# EAGLE design amplifier_modified2 (EAGLE 6.1)
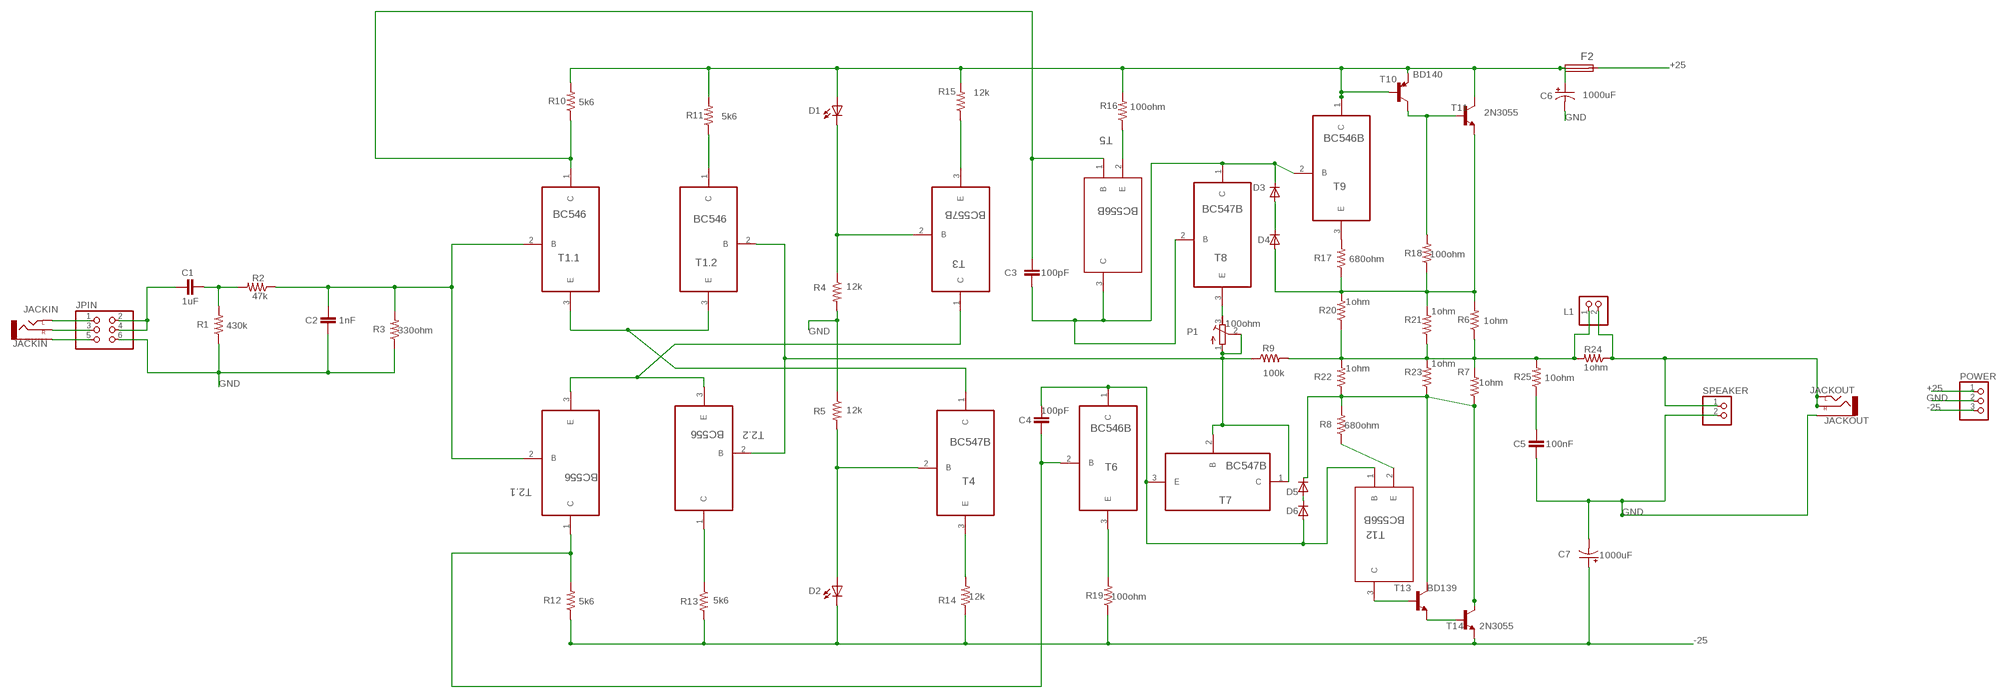
[diagram p0: schematic, sheet 1]

## Parts
C1  1uF  CAPPTH1  [CAP-PTH-5MM]
C2  1nF  CAPPTH1  [CAP-PTH-5MM]
C3  100pF  C5/3  [C5B3]
C4  100pF  C5/3  [C5B3]
C5  100nF  C5/3  [C5B3]
C6  1000uF  CPOL-USE5-6  [E5-6]
C7  1000uF  CPOL-USE5-6  [E5-6]
D1  LED5MM  [LED5MM]
D2  LED5MM  [LED5MM]
D3  1N4148DO35-10  [DO35-10]
D4  1N4148DO35-10  [DO35-10]
D5  1N4148DO35-10  [DO35-10]
D6  1N4148DO35-10  [DO35-10]
F2  FUSEBLANK_5X20MM  [FUSE_HOLDER_5X20MM]
JACKIN  JACKIN  AUDIO-JACK2.5MM  [STEREOJACK2.5MM_STEREOJACK2.5MM]
JACKOUT  JACKOUT  AUDIO-JACK2.5MM  [STEREOJACK2.5MM_STEREOJACK2.5MM]
JPIN  PINHD-2X3/90  [2X03/90]
L1  PINHD-1X2/90  [1X02/90]
P1  100ohm  R-TRIMM74X  [RTRIM74X]
POWER  PINHD-1X3/90  [1X03/90]
R1  430k  RESISTORPTH-2W  [AXIAL-0.8]
R2  47k  RESISTORPTH-2W  [AXIAL-0.8]
R3  330ohm  RESISTORPTH-2W  [AXIAL-0.8]
R4  12k  RESISTORPTH-2W  [AXIAL-0.8]
R5  12k  RESISTORPTH-2W  [AXIAL-0.8]
R6  1ohm  RESISTORPTH-2W  [AXIAL-0.8]
R7  1ohm  RESISTORPTH-2W  [AXIAL-0.8]
R8  680ohm  RESISTORPTH-2W  [AXIAL-0.8]
R9  100k  RESISTORPTH-2W  [AXIAL-0.8]
R10  5k6  RESISTORPTH-2W  [AXIAL-0.8]
R11  5k6  RESISTORPTH-2W  [AXIAL-0.8]
R12  5k6  RESISTORPTH-2W  [AXIAL-0.8]
R13  5k6  RESISTORPTH-2W  [AXIAL-0.8]
R14  12k  RESISTORPTH-2W  [AXIAL-0.8]
R15  12k  RESISTORPTH-2W  [AXIAL-0.8]
R16  100ohm  RESISTORPTH-2W  [AXIAL-0.8]
R17  680ohm  RESISTORPTH-2W  [AXIAL-0.8]
R18  100ohm  RESISTORPTH-2W  [AXIAL-0.8]
R19  100ohm  RESISTORPTH-2W  [AXIAL-0.8]
R20  1ohm  RESISTORPTH-2W  [AXIAL-0.8]
R21  1ohm  RESISTORPTH-2W  [AXIAL-0.8]
R22  1ohm  RESISTORPTH-2W  [AXIAL-0.8]
R23  1ohm  RESISTORPTH-2W  [AXIAL-0.8]
R24  1ohm  RESISTORPTH-2W  [AXIAL-0.8]
R25  10ohm  RESISTORPTH-2W  [AXIAL-0.8]
SPEAKER  PINHD-1X2/90  [1X02/90]
T1.1  BC546  BC546B  [TO127P254X732-3]
T1.2  BC546  BC546B  [TO127P254X732-3]
T2.1  BC556  BC556B  [TO127P254X732-3]
T2.2  BC556  BC556B  [TO127P254X732-3]
T3  BC557B  [TO127P254X732-3]
T4  BC547B  [TO127P254X732-3]
T5  BC556B  BC857A  [SOT95P240X110-3N]
T6  BC546B  [TO127P254X732-3]
T7  BC547B  [TO127P254X732-3]
T8  BC547B  [TO127P254X732-3]
T9  BC546B  [TO127P254X732-3]
T10  BD140  [TO126]
T11  2N3055  [TO3]
T12  BC556B  BC857A  [SOT95P240X110-3N]
T13  BD139  [TO126]
T14  2N3055  [TO3]

## Nets
+25: F2.2 POWER.1
-25: C7.+ D2.K(C) POWER.3 R12.P$1 R13.P$2 R14.P$1 R19.P$1 T14.E
GND: C2.1 C5.1 C6.- C7.- JACKOUT.RING1(SLEEVE) JPIN.6 POWER.2 R1.P$1 R3.P$1 R4.P$2 R5.P$1 SPEAKER.2
N$1: JACKIN.SHIELD(LEFT) JPIN.1
N$2: C1.2 R1.P$2 R2.P$2
N$4: C2.2 R2.P$1 R3.P$2 T1.1.2(B) T2.1.2(B)
N$5: P1.3(E) T8.3(E)
N$6: T2.1.3(E) T2.2.3(E) T3.1(C)
N$7: P1.1(A) P1.2(S) R9.P$1 T1.2.2(B) T2.2.2(B) T7.1(C) T7.2(B)
N$8: C3.2 R10.P$1 T1.1.1(C) T5.1(B)
N$9: T1.1.3(E) T1.2.3(E) T4.1(C)
N$10: C4.1 R12.P$2 T2.1.1(C) T6.2(B)
N$12: R11.P$1 T1.2.1(C)
N$13: C5.2 R25.P$1
N$14: D1.K(C) R4.P$1 T3.2(B)
N$15: R13.P$1 T2.2.1(C)
N$17: D2.A R5.P$2 T4.2(B)
N$18: R14.P$2 T4.3(E)
N$19: R15.P$1 T3.3(E)
N$20: R16.P$1 T5.2(E)
N$21: C3.1 D3.C T5.3(C) T8.1(C) T8.2(B) T9.2(B)
N$22: R19.P$2 T6.3(E)
N$23: C4.2 D6.A T6.1(C) T7.3(E) T12.1(B)
N$24: JACKIN.RING1(SLEEVE) JPIN.5
N$25: JACKIN.TIP(RIGHT) JPIN.3
N$26: D5.A D6.C
N$27: R17.P$2 T9.3(E)
N$28: D3.A D4.C
N$29: D4.A R6.P$2 R17.P$1 R18.P$1 R20.P$2 R21.P$2 T11.E
N$30: C6.+ D1.A F2.1 R10.P$2 R11.P$2 R15.P$2 R16.P$2 T9.1(C) T10.1(E) T10.3(B) T11.C T11.C/(C)
N$31: R18.P$2 T10.2(C) T11.B
N$32: R8.P$1 T12.2(E)
N$33: T12.3(C) T13.3(B)
N$34: T13.1(E) T14.B
N$35: JACKOUT.SHIELD(LEFT) JACKOUT.TIP(RIGHT) L1.2 R24.P$1 SPEAKER.1
N$36: L1.1 R6.P$1 R7.P$2 R9.P$2 R20.P$1 R21.P$1 R22.P$2 R23.P$2 R24.P$2 R25.P$2
N$37: D5.C R7.P$1 R8.P$2 R22.P$1 R23.P$1 T13.2(C) T14.C T14.C/(C)
N$40: C1.1 JPIN.2 JPIN.4

## Library data of the parts
C1 C2 = SparkFun-Capacitors:CAP: Capacitor Standard 0603 ceramic capacitor, and 0.1" leaded capacitor.
C3-C5 = capacitor-wima:C: CAPACITOR naming: grid - package width
C6 C7 = rcl:CPOL-US: POLARIZED CAPACITOR, American symbol
D1 D2 = led:LED: LED OSRAM: - CHIPLED LG R971, LG N971, LY N971, LG Q971, LY Q971, LO R971, LY R971 LH N974, LH R974 LS Q976, LO Q976, LY Q976 LO Q996 - Hyper CHIPLED LW Q18S LB Q993, LB Q99A, LB R99A - SideLED LS A670, LO A670, LY A670, LG A670, LP A670 LB A673, LV A673, LT A673, LW A673 LH A674 LY A675 LS A676, LA A676, LO A676, LY A676, LW A676 LS A679, LY A679, LG A679 - Hyper Micro SIDELED® LS Y876, LA Y876, LO Y876, LY Y876 LT Y87S - SmartLED LW L88C, LW L88S LB L89C, LB L89S, LG L890 LS L89K, LO L89K, LY L89K LS L896, LA L896, LO L896, LY L896 - TOPLED LS T670, LO T670, LY T670, LG T670, LP T670 LSG T670, LSP T670, LSY T670, LOP T670, LYG T670 LG T671, LOG T671, LSG T671 LB T673, LV T673, LT T673, LW T673 LH T674 LS T676, LA T676, LO T676, LY T676, LB T676, LH T676, LSB T676, LW T676 LB T67C, LV T67C, LT T67C, LS T67K, LO T67K, LY T67K, LW E67C LS E67B, LA E67B, LO E67B, LY E67B, LB E67C, LV E67C, LT E67C LW T67C LS T679, LY T679, LG T679 LS T770, LO T770, LY T770, LG T770, LP T770 LB T773, LV T773, LT T773, LW T773 LH T774 LS E675, LA E675, LY E675, LS T675 LS T776, LA T776, LO T776, LY T776, LB T776 LHGB T686 LT T68C, LB T68C - Hyper Mini TOPLED® LB M676 - Mini TOPLED Santana® LG M470 LS M47K, LO M47K, LY M47K Source: http://www.osram.convergy.de LUXEON: - LUMILED® LXK2-PW12-R00, LXK2-PW12-S00, LXK2-PW14-U00, LXK2-PW14-V00 LXK2-PM12-R00, LXK2-PM12-S00, LXK2-PM14-U00 LXK2-PE12-Q00, LXK2-PE12-R00, LXK2-PE12-S00, LXK2-PE14-T00, LXK2-PE14-U00 LXK2-PB12-K00, LXK2-PB12-L00, LXK2-PB12-M00, LXK2-PB14-N00, LXK2-PB14-P00, LXK2-PB14-Q00 LXK2-PR12-L00, LXK2-PR12-M00, LXK2-PR14-Q00, LXK2-PR14-R00 LXK2-PD12-Q00, LXK2-PD12-R00, LXK2-PD12-S00 LXK2-PH12-R00, LXK2-PH12-S00 LXK2-PL12-P00, LXK2-PL12-Q00, LXK2-PL12-R00 Source: www.luxeon.com KINGBRIGHT: KA-3528ASYC Source: www.kingbright.com
D3-D6 = diode:1N4148: DIODE high speed (Philips)
F2 = fuse:FUSE: Fuse; OC_FARNELL: unknown; OC_NEWARK: unknown
JACKIN JACKOUT = SparkFun-Connectors:AUDIO-JACK: 3.5mm Audio Jack Simple 3.5mm common PCB mount audio jack. SKU: PRT-08032
JPIN = pinhead:PINHD-2X3: PIN HEADER
L1 SPEAKER = pinhead:PINHD-1X2: PIN HEADER
P1 = rcl:R-TRIMM: Trimm resistor
POWER = pinhead:PINHD-1X3: PIN HEADER
R1-R5 R8-R19 R25 = SparkFun-Resistors:RESISTOR: Resistor Basic schematic elements and footprints for 0603, 1206, and PTH resistors.
R6 R7 R20-R24 = SparkFun-Passives:RESISTOR: Resistor Basic schematic elements and footprints for 0603, 1206, and PTH resistors.
T1.1 T1.2 T6 T9 = Fairchild_By_element14_Batch_1:BC546B: NPN Epitaxial Silicon Transistor; MPN: BC546B; OC_FARNELL: 1467868; OC_NEWARK: 58K8752; PACKAGE: TO-92; SUPPLIER: Fairchild
T2.1 T2.2 = Fairchild_By_element14_Batch_1:BC556B: PNP Epitaxial Silicon Transistor; MPN: BC556B; OC_FARNELL: 1467881; OC_NEWARK: 58K8759; PACKAGE: TO-92; SUPPLIER: Fairchild
T3 = Fairchild_By_element14_Batch_1:BC557B: PNP Epitaxial Silicon Transistor; MPN: BC557B; OC_FARNELL: 1017678; OC_NEWARK: 58K0100; PACKAGE: TO-92; SUPPLIER: Fairchild
T4 T7 T8 = Fairchild_By_element14_Batch_1:BC547B: NPN Epitaxial Silicon Transistor; MPN: BC547B; OC_FARNELL: 1017673; OC_NEWARK: 67K3328; PACKAGE: TO-92; SUPPLIER: Fairchild
T5 T12 = Diodes_Inc_By_element14_Batch_1:BC857A: PNP SURFACE MOUNT SMALL SIGNAL TRANSISTOR IN SOT23; MPN: BC857A; OC_FARNELL: 1902487; OC_NEWARK: -; PACKAGE: SOT-23-3; SUPPLIER: DIODES INC.
T10 = transistor-pnp:BD140: PNP Transistor
T11 T14 = transistor:2N3055: NPN TRANSISTOR
T13 = transistor:BD139: NPN TRANSISTOR

## Net classes
0 probots: width 0.406 mm, drill 0.762 mm, clearance 0.457 mm

## Board
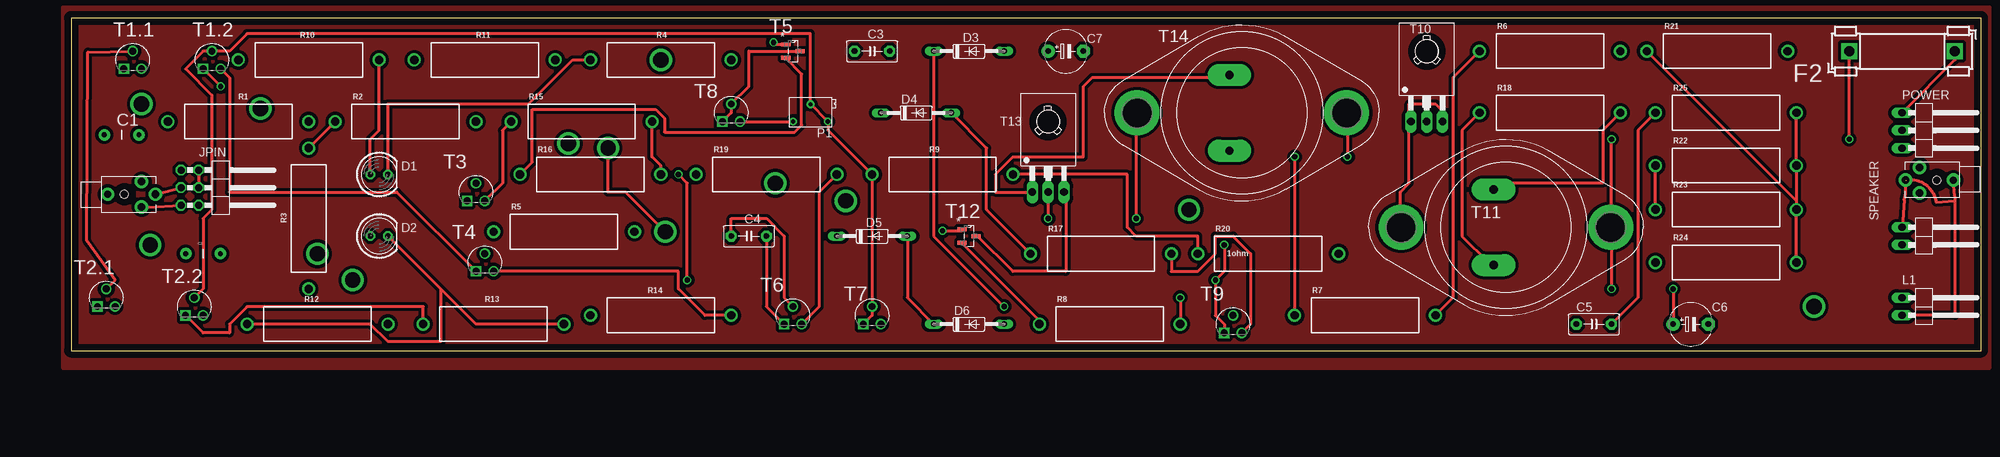
[diagram p1: board, top side]
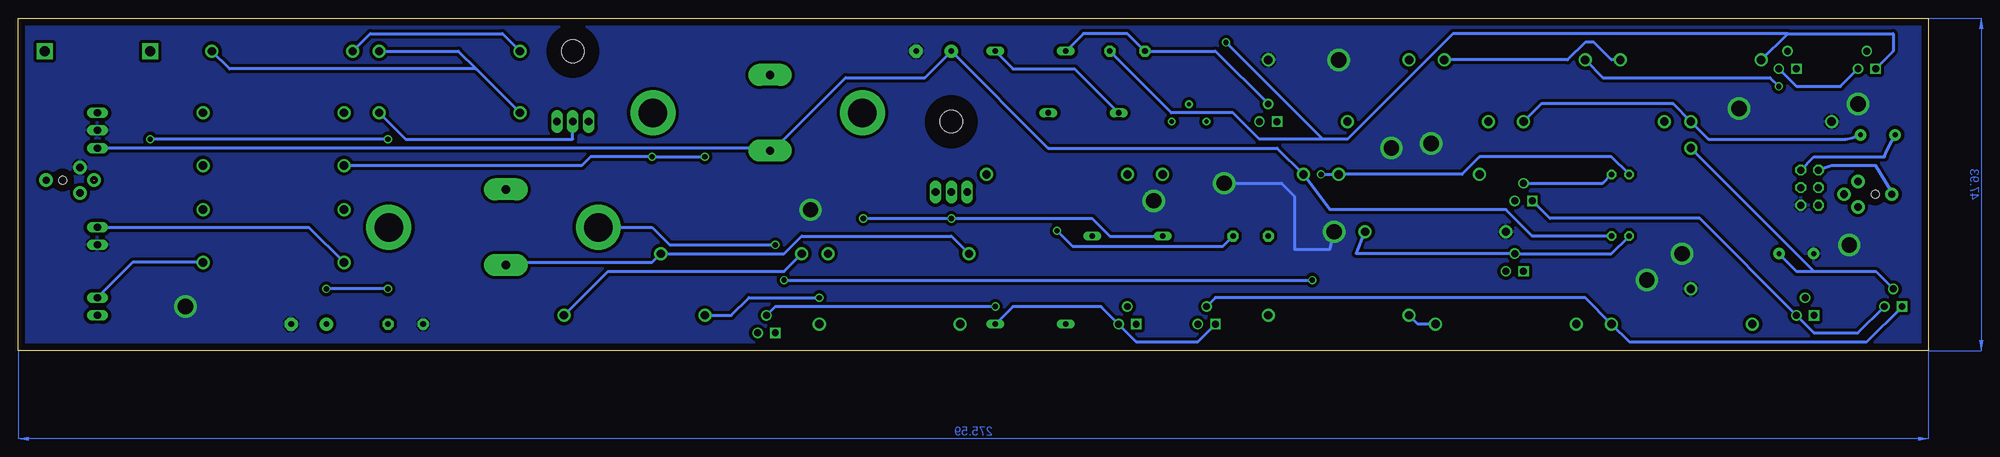
[diagram p2: board, bottom side, seen from below]

Size 275.57 x 47.93 mm. Coordinates in mm from the lower left corner, seen from the top.
Outline: 0,0 275.57,0 275.57,47.93 0,47.93 0,0
Copper layers (1*16): Top 0.035mm / dielectric 1.5mm / Bottom 0.035mm
Design rules: minimum track width 16mil, minimum drill 30mil, track to track 18mil, track to pad 8mil, pad to pad 8mil, via to via 8mil, smd to smd 8mil, copper to edge 40mil, drill to drill 8mil, minimum pad ring 10mil, minimum via ring 8mil, stop-mask expansion 4mil, vias tented up to drill 0mil, thermal gap 10mil

### Footprints (pad centres in the part's own frame; a part is rotated, then mirrored left to right if it is on the bottom)
CAP-PTH-5MM = drill 0.7 pad 1.651: 1 -2.5,0; 2 2.5,0
C5B3 = drill 0.813 pad 1.6 octagon: 1 -2.54,0; 2 2.54,0
E5-6 = drill 0.813 pad 1.905: + -2.54,0 | drill 0.813 pad 1.905 octagon: - 2.54,0
LED5MM = drill 0.813 octagon: A -1.27,0; K 1.27,0
DO35-10 = drill 0.813 long: A 5.08,0; C -5.08,0
FUSE_HOLDER_5X20MM = drill 1.422 pad 2.286 square: 1 0,0; 2 15.24,0
STEREOJACK2.5MM_STEREOJACK2.5MM = drill 1.1 pad 1.93: RING1 2.5,-1.85; RING2 2.5,1.85; TIP 4.5,0 | drill 1 pad 1.93: SHIELD -2.4,0 | hole 1.2: 0,0
2X03/90 = drill 1.016 octagon: 1 -2.54,-6.35; 2 -2.54,-3.81; 3 0,-6.35; 4 0,-3.81; 5 2.54,-6.35; 6 2.54,-3.81
1X02/90 = drill 1.016 long: 1 -1.27,-3.81; 2 1.27,-3.81
RTRIM74X = drill 0.61: 1 -1.25,-2.5; 2 1.25,0; 3 -1.25,2.5
1X03/90 = drill 1.016 long: 1 -2.54,-3.81; 2 0,-3.81; 3 2.54,-3.81
AXIAL-0.8 = drill 1.2 pad 1.88: P$1 -10.16,0; P$2 10.16,0
TO127P254X732-3 = drill 0.991 square: 1 -2.54,-2.54 | drill 0.991: 2 -1.27,0; 3 0,-2.54
SOT95P240X110-3N = smd 1.321 x 0.559: 1 -1.016,0.965; 2 -1.016,-0.965; 3 1.016,0
TO126 = drill 1.118 long: 1 -2.286,-5.08; 2 0,-5.08; 3 2.286,-5.08 | hole 3.302: 0,5.08
TO3 = drill 1.194 pad 3.15 long: B -1.778,5.461; E -1.778,-5.461 | drill 4.115 pad 6.477: C 15.113,0; C/ -15.113,0

### Placement (x,y rotation side)
C1  7.3,31.11 0 top
C2  19.05,13.97 0 top
C3  115.57,43.18 0 top
C4  97.79,16.51 0 top
C5  219.71,3.81 0 top
C6  233.68,3.81 0 top
C7  143.51,43.18 0 top
D1  44.45,25.4 0 top
D2  44.45,16.51 0 top
D3  129.54,43.18 0 top
D4  121.92,34.29 0 top
D5  115.57,16.51 0 top
D6  129.54,3.81 0 top
F2  256.54,43.18 0 top
JACKIN  7.68,22.54 0 top
JACKOUT  269.18,24.57 180 top
JPIN  22.23,23.5 270 top
L1  267.97,6.35 270 top
P1  106.68,34.29 90 top
POWER  267.97,31.75 270 top
R1  24.13,33.02 0 top
R2  48.26,33.02 0 top
R3  34.29,19.05 90 top
R4  85.09,41.91 0 top
R5  71.12,17.14 0 top
R6  213.36,43.18 0 top
R7  186.69,5.08 0 top
R8  149.86,3.81 0 top
R9  125.73,25.4 0 top
R10  34.29,41.91 0 top
R11  59.69,41.91 0 top
R12  35.56,3.81 0 top
R13  60.96,3.81 0 top
R14  85.09,5.08 0 top
R15  73.66,33.02 0 top
R16  74.93,25.4 0 top
R17  148.59,13.97 0 top
R18  213.36,34.29 0 top
R19  100.33,25.4 0 top
R20  172.72,13.97 0 top
R21  237.49,43.18 0 top
R22  238.76,26.67 0 top
R23  238.76,20.32 0 top
R24  238.76,12.7 0 top
R25  238.76,34.29 0 top
SPEAKER  267.97,16.51 270 top
T1.1  10.16,43.18 0 top
T1.2  21.59,43.18 0 top
T2.1  6.35,8.89 0 top
T2.2  19.05,7.62 0 top
T3  59.69,24.13 0 top
T4  60.96,13.97 0 top
T5  104.14,43.18 0 top
T6  105.41,6.35 0 top
T7  116.84,6.35 0 top
T8  96.52,35.56 0 top
T9  168.91,5.08 0 top
T10  195.58,38.1 0 top
T11  207.01,17.78 0 top
T12  129.54,16.51 0 top
T13  140.97,27.94 0 top
T14  168.91,34.29 0 top

### Tracks (layer width: path | path; a pad name or v marks a point on that pad's centre or on a via)
+25
  Top 0.406: POWER.1 271.78,41.91 F2.2
-25
  Top 0.406: 53.34,8.89 58.42,3.81 R13.P$2 | 53.34,8.89 D2.K | R12.P$1 43.18,3.81 45.72,1.27 53.34,1.27 53.34,8.89
  Bottom 0.406: R14.P$1 73.66,3.81 R13.P$2 | D2.K 57.15,16.51 60.96,20.32 86.36,20.32 R19.P$1 93.98,29.21 127,29.21 C7.+ 144.78,39.37 156.21,39.37 166.37,29.21 T14.E 167.64,29.21 POWER.3
GND  (via drill 2.2)
  Top 0.406: v77.47,29.21 77.47,22.86 80.01,22.86 v85.73,17.14
  Bottom 0.406: v101.6,24.13 93.34,24.13 91.44,22.22 91.44,14.61 86.36,14.61 v85.73,17.14
  other vias: 40.64,10.16 35.56,13.97 11.43,15.24 27.3,34.92 111.76,21.59 161.29,20.32 251.46,6.35 10.16,35.56 85.09,41.91 71.75,29.84
  pour Bottom: -2.54,53.34 -2.54,-6.35 279.4,-6.35 279.4,53.34
N$1
  Bottom 0.406: JPIN.1 13.97,26.67 7.62,26.67 5.46,23.11 JACKIN.SHIELD
N$2
  Bottom 0.406: C1.2 10.99,30.67 11.94,30.48 31.75,30.48 R1.P$2 36.83,35.56 55.88,35.56 R2.P$2
N$4
  Top 0.406: R2.P$1 R3.P$2 | T1.1.2 2.41,43.05 2.29,15.81 4.38,12.95 6.35,10.16 T2.1.2
  Bottom 0.406: T2.1.2 7.62,11.43 16.51,11.43 | 16.51,11.43 19.05,11.43 21.59,13.97 C2.2 | 16.51,11.43 R3.P$2
N$5
  Top 0.406: T8.3 104.14,33.02 P1.3
N$6
  Bottom 0.406: T2.1.3 10.16,2.54 16.51,2.54 T2.2.3 33.02,19.05 54.61,19.05 T3.1
N$7
  Top 0.406: T2.2.2 19.05,8.89 19.05,19.05 20.32,20.32 20.32,36.83 16.51,40.64 19.05,43.18 T1.2.2 22.86,43.18 25.4,45.72 106.68,45.72 106.68,35.56 | T7.1 115.57,5.08 T7.2 R9.P$1 109.22,31.75 109.22,33.02 | 109.22,33.02 106.68,35.56 | 109.22,33.02 P1.1 | 106.68,35.56 P1.2
N$8  (via drill 0.76)
  Top 0.406: v101.35,44.45 101.35,44.2 103.12,44.2 T5.1
  Bottom 0.406: T1.1.1 5.08,43.18 5.08,45.72 20.32,45.72 | R10.P$1 20.32,45.72 | C3.2 109.22,34.29 100.33,34.29 96.52,30.48 87.38,30.48 | 87.38,30.48 83.82,30.48 68.58,45.72 20.32,45.72 | 87.38,30.48 v101.35,44.45
N$9
  Top 0.406: T4.1 46.99,22.86 22.86,22.86 22.86,39.37 T1.2.3
  Bottom 0.406: T1.1.3 12.7,38.1 19.05,38.1 T1.2.3
N$10
  Top 0.406: T6.2 102.87,7.62 102.87,16.51 100.33,19.05 95.25,19.05 C4.1
  Bottom 0.406: T2.1.1 8.89,1.27 43.18,1.27 R12.P$2 49.53,7.62 102.87,7.62 T6.2
N$11
  pour Top: -1.27,49.53 -1.27,-2.54 276.86,-2.54 276.86,49.53
N$12  (via drill 0.76)
  Top 0.406: v21.59,38.1 T1.2.1
  Bottom 0.406: v21.59,38.1 22.86,39.37 46.99,39.37 R11.P$1
N$13
  Top 0.406: C5.2 226.06,7.62 226.06,31.75 R25.P$1
N$14
  Top 0.406: R4.P$1 72.39,41.91 66.04,35.56 45.72,35.56 D1.K
  Bottom 0.406: D1.K 46.99,24.13 T3.2
N$15
  Top 0.406: T2.2.1 19.05,2.54 22.86,2.54 22.86,3.81 25.4,6.35 50.8,6.35 R13.P$1
N$17
  Bottom 0.406: D2.A 45.72,13.97 T4.2 82.55,13.97 R5.P$2
N$18
  Top 0.406: T4.3 87.63,11.43 87.63,8.89 91.44,5.08 R14.P$2
N$19
  Top 0.406: T3.3 62.23,24.13 62.23,31.75 R15.P$1
N$20
  Top 0.406: R16.P$1 66.55,27.18 66.55,34.8 84.33,34.8 85.6,33.53 85.6,31.5 104.39,31.5 105.41,32.51 105.41,39.88 103.12,42.16 T5.2
N$21  (via drill 0.76)
  Top 0.406: 105.41,43.18 T5.3 97.79,43.18 97.79,38.1 T8.2 95.25,34.29 T8.1 | v134.62,6.35 124.46,16.51 D3.C
  Bottom 0.406: D3.C 121.92,45.72 115.57,45.72 C3.1 102.87,43.18 T8.2 | T9.2 166.37,6.35 v134.62,6.35
N$22
  Top 0.406: T6.3 107.95,6.35 107.95,22.86 R19.P$2
N$23  (via drill 0.76)
  Top 0.406: T6.1 100.33,6.35 C4.2 | v125.73,17.27 128.52,17.27 T12.1
  Bottom 0.406: D6.A 132.08,6.35 119.38,6.35 T7.3 114.3,1.27 105.41,1.27 T6.1 | v125.73,17.27 123.44,14.99 101.85,14.99 C4.2
N$24
  Top 0.406: JPIN.5 11.05,20.64 JACKIN.RING1
N$25
  Top 0.406: JACKIN.TIP JPIN.3
N$26
  Top 0.406: D6.C 120.65,7.62 D5.A
N$27
  Top 0.406: T9.3 170.18,3.81 170.18,13.97 167.64,16.51 165.1,16.51 165.1,13.97 162.56,11.43 158.75,11.43 R17.P$2
N$28
  Bottom 0.406: D4.C 123.19,40.64 132.08,40.64 D3.A
N$29
  Top 0.406: D4.A 132.08,29.21 132.08,20.32 R17.P$1 | R18.P$1 200.66,31.75 200.66,16.51 204.47,12.7 T11.E
  Bottom 0.406: T11.E 204.47,12.7 184.15,12.7 R20.P$2 165.1,13.97 162.56,16.51 140.97,16.51 R17.P$1 | 209.55,40.64 212.09,43.18 R6.P$2 | 209.55,40.64 R18.P$1 | R21.P$2 245.11,40.64 209.55,40.64
N$30  (via drill 0.76)
  Top 0.406: R15.P$2 83.82,27.94 85.09,26.67 R16.P$2 | R10.P$2 44.45,31.75 43.18,30.48 D1.A | 193.04,33.02 193.04,35.56 196.85,35.56 198.12,34.29 198.12,33.02 T10.3 | T9.1 166.37,3.81 165.1,5.08 v165.1,10.16 166.37,11.43 v166.37,15.24 | v231.14,8.89 C6.+ | 222.25,17.78 v222.25,8.89 | v256.54,30.48 F2.1 | 222.25,17.78 v222.25,30.48 | 222.25,17.78 T11.C | 193.04,33.02 193.04,24.13 191.77,22.86 191.77,17.78 T11.C/ | 193.04,33.02 T10.1 | v87.63,25.4 88.9,24.13 v88.9,10.16
  Bottom 0.406: R11.P$2 52.07,41.91 49.53,44.45 48.26,44.45 45.72,41.91 R10.P$2 | D1.A 45.72,27.94 64.77,27.94 67.31,25.4 R16.P$2 v87.63,25.4 | v166.37,15.24 181.61,15.24 184.15,17.78 T11.C/ | v222.25,8.89 v231.14,8.89 | v222.25,30.48 v256.54,30.48 | v165.1,10.16 v88.9,10.16
N$31
  Top 0.406: R18.P$2 220.98,31.75 220.98,24.13 205.74,24.13 T11.B
  Bottom 0.406: T10.2 195.58,30.48 219.71,30.48 R18.P$2
N$32
  Top 0.406: R8.P$1 139.7,4.32 128.52,15.49 T12.2
N$33
  Top 0.406: T12.3 130.81,16.51 135.89,11.43 143.51,11.43 143.51,22.86 T13.3
N$34
  Top 0.406: T13.1 133.35,22.86 133.35,25.4 135.89,27.94 146.05,27.94 146.05,38.1 147.32,39.37 166.37,39.37 T14.B
N$35  (1 unrouted)
  Top 0.406: 264.73,24.51 arc-90 264.8,24.57 264.92,24.64 arc-90 269.05,21.4 271.78,21.59 | L1.2 271.78,5.08 271.78,21.59 | 271.78,21.59 271.78,22.22 JACKOUT.SHIELD | SPEAKER.1 264.48,21.72 264.67,22.67 JACKOUT.TIP
  Bottom 0.406: R24.P$1 233.68,17.78 SPEAKER.1
N$36
  Top 0.406: R9.P$2 152.4,25.4 152.4,17.78 153.67,16.51 162.56,16.51 R20.P$1 | 248.92,21.59 R22.P$2 R25.P$2 | 248.92,21.59 R23.P$2 R24.P$2 | 248.92,21.59 R21.P$1 | R7.P$2 199.39,7.62 199.39,39.37 R6.P$1
  Bottom 0.406: R20.P$1 165.1,11.43 190.5,11.43 R7.P$2 | R6.P$1 205.74,45.72 224.79,45.72 R21.P$1 | L1.1 259.08,12.7 R24.P$2
N$37  (via drill 0.76)
  Top 0.406: T13.2 v140.97,19.05 | v160.02,7.62 R8.P$2 | R23.P$1 R22.P$1 | v184.15,27.94 184.15,34.29 T14.C | v176.53,27.94 R7.P$1 | v153.67,19.05 153.67,34.29 T14.C/
  Bottom 0.406: D5.C 118.11,16.51 120.65,19.05 v140.97,19.05 v153.67,19.05 | v160.02,7.62 170.18,7.62 172.72,5.08 R7.P$1 | R22.P$1 194.31,26.67 193.04,27.94 v184.15,27.94 v176.53,27.94
N$40
  Top 0.406: JPIN.2 JPIN.4
  Bottom 0.406: JPIN.2 16.51,27.94 6.35,27.94 5.97,28.96 C1.1
(copper drawn outside any net)
  shapes: Bottom area x2